# Altium project wifi-SA.PrjPcb
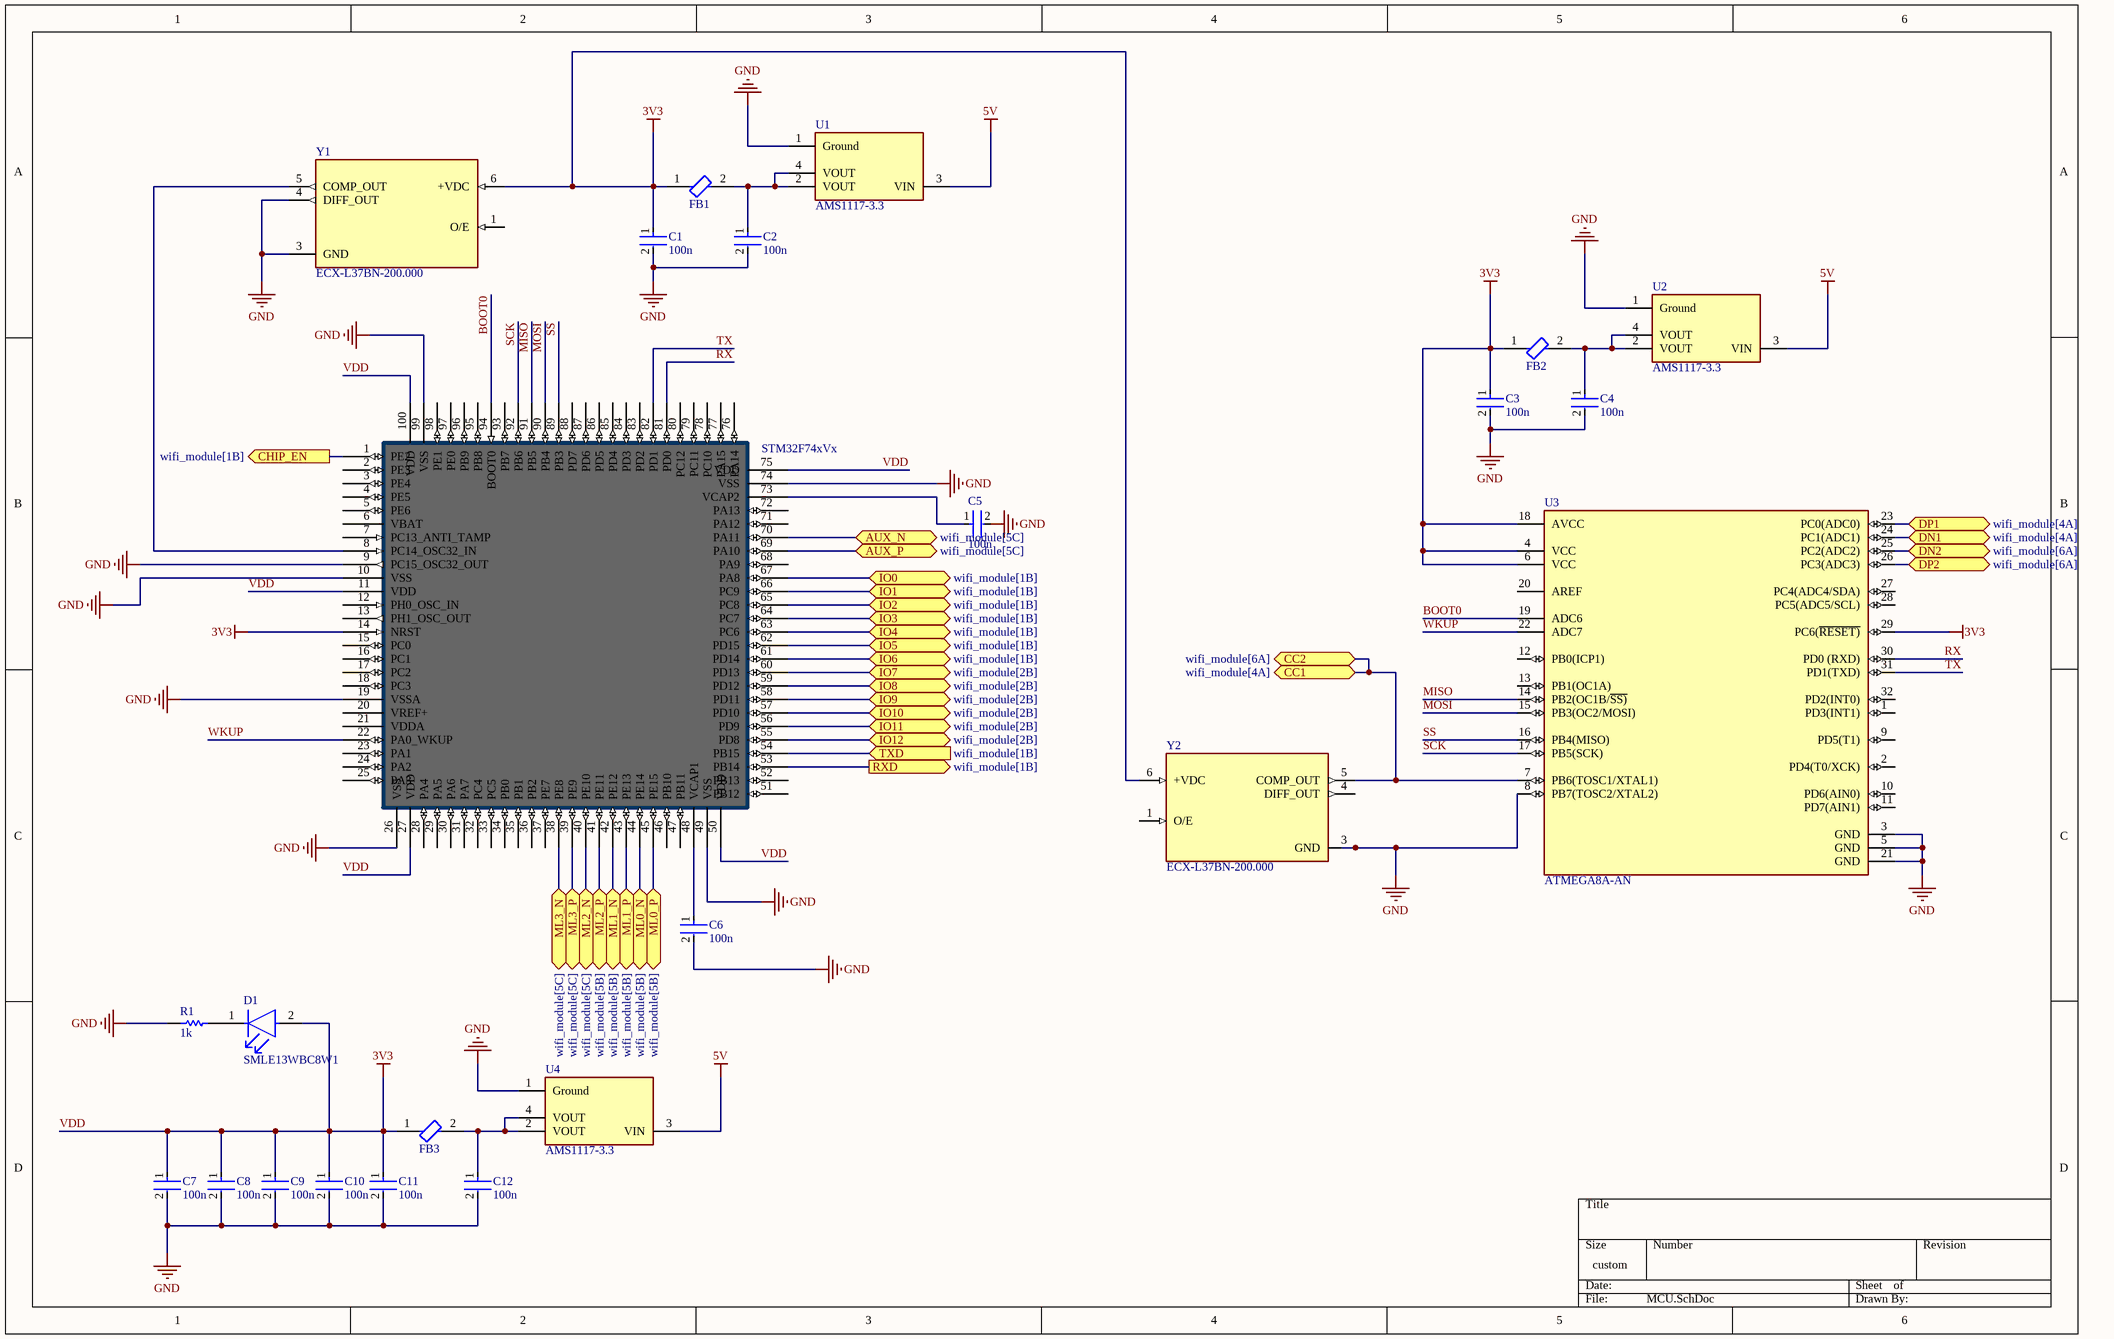
[diagram p0: MCU.SchDoc]
2 sheets, 36 parts. Net scope: flat (ports and power ports of the same name join across sheets).
Board file: wifi-SA.PcbDoc
Sheets:
  MCU.SchDoc
  wifi_module.SchDoc

## Sheet MCU.SchDoc
size 389 x 250 mm; SheetNumber: 1; SheetTotal: 2

### Parts
C1  100n  [FP-CL10-IPC_C]
C2  100n  [FP-CL10-IPC_C]
C3  100n  [FP-CL10-IPC_C]
C4  100n  [FP-CL10-IPC_C]
C5  100n  [FP-CL10-IPC_C]
C6  100n  [FP-CL10-IPC_C]
C7  100n  [FP-CL10-IPC_C]
C8  100n  [FP-CL10-IPC_C]
C9  100n  [FP-CL10-IPC_C]
C10  100n  [FP-CL10-IPC_C]
C11  100n  [FP-CL10-IPC_C]
C12  100n  [FP-CL10-IPC_C]
D1  SMLE13WBC8W1  [FP-SMLE13WBC8W1-MFG]
FB1  BLM18KG121TN1D  [FP-BLM18-0_15-t0_6-d1_2-IPC_A]  (value not drawn)
FB2  BLM18KG121TN1D  [FP-BLM18-0_15-t0_6-d1_2-IPC_A]  (value not drawn)
FB3  BLM18KG121TN1D  [FP-BLM18-0_15-t0_6-d1_2-IPC_A]  (value not drawn)
R1  1k  [RESC2013X60X35ML10T20]
U0  STM32F74xVx  [CQFP-STM32F74xVx]
U1  AMS1117-3.3  [FP-AMS1117-IPC_C]
U2  AMS1117-3.3  [FP-AMS1117-IPC_C]
U3  ATMEGA8A-AN  [FP-C04-074-PT-MFG]
U4  AMS1117-3.3  [FP-AMS1117-IPC_C]
Y1  ECX-L37BN-200.000  [OSC_ECX-L37BN-200.000]
Y2  ECX-L37BN-200.000  [OSC_ECX-L37BN-200.000]

### Ports
AUX_N (bidir, see wifi_module[5C]), AUX_P (bidir, see wifi_module[5C]), CC1 (bidir, see wifi_module[4A]), CC2 (bidir, see wifi_module[6A]), CHIP_EN (out, see wifi_module[1B]), DN1 (bidir, see wifi_module[4A]), DN2 (bidir, see wifi_module[6A]), DP1 (bidir, see wifi_module[4A]), DP2 (bidir, see wifi_module[6A]), IO0 (bidir, see wifi_module[1B]), IO1 (bidir, see wifi_module[1B]), IO2 (bidir, see wifi_module[1B]), IO3 (bidir, see wifi_module[1B]), IO4 (bidir, see wifi_module[1B]), IO5 (bidir, see wifi_module[1B]), IO6 (bidir, see wifi_module[1B]), IO7 (bidir, see wifi_module[2B]), IO8 (bidir, see wifi_module[2B]), IO9 (bidir, see wifi_module[2B]), IO10 (bidir, see wifi_module[2B]), IO11 (bidir, see wifi_module[2B]), IO12 (bidir, see wifi_module[2B]), ML0_N (bidir, see wifi_module[5B]), ML0_P (bidir, see wifi_module[5B]), ML1_N (bidir, see wifi_module[5B]), ML1_P (bidir, see wifi_module[5B]), ML2_N (bidir, see wifi_module[5C]), ML2_P (bidir, see wifi_module[5B]), ML3_N (bidir, see wifi_module[5C]), ML3_P (bidir, see wifi_module[5C]), RXD (out, see wifi_module[1B]), TXD (in, see wifi_module[1B])

### Nets
5V: U1.3(VIN) U2.3(VIN) U4.3(VIN)
GND: C1.2 C2.2 C3.2 C4.2 C5.2 C6.2 C7.2 C8.2 C9.2 C10.2 C11.2 C12.2 R1.1 U0.9(PC15_OSC32_OUT) U0.10(VSS) U0.19(VSSA) U0.26(VSS) U0.49(VSS) U0.74(VSS) U0.99(VSS) U1.1(Ground) U2.1(Ground) U3.3(GND) U3.5(GND) U3.8(PB7(TOSC2/XTAL2)) U3.21(GND) U4.1(Ground) Y1.3(GND) Y1.4(DIFF_OUT) Y2.3(GND)
VDD: C1.1 C3.1 C7.1 C8.1 C9.1 C10.1 C11.1 D1.2(A) FB1.1 FB2.1 FB3.1 U0.11(VDD) U0.14(NRST) U0.27(VDD) U0.50(VDD) U0.75(VDD) U0.100(VDD) U3.4(VCC) U3.6(VCC) U3.18(AVCC) U3.29(PC6(~{RESET)}) Y1.6(+VDC) Y2.6(+VDC)  [also labelled 3V3]
AUX_N: U0.70(PA11) ; port AUX_N
AUX_P: U0.69(PA10) ; port AUX_P
BOOT0: U0.94(BOOT0) U3.19(ADC6)
D1_N: U3.24(PC1(ADC1)) ; port DN1
D1_P: U3.23(PC0(ADC0)) ; port DP1
D2_N: U3.25(PC2(ADC2)) ; port DN2
D2_P: U3.26(PC3(ADC3)) ; port DP2
MISO: U0.91(PB5) U3.14(PB2(OC1B/~{SS)})
ML0_N: U0.44(PE14) ; port ML0_N
ML0_P: U0.45(PE15) ; port ML0_P
ML1_N: U0.42(PE12) ; port ML1_N
ML1_P: U0.43(PE13) ; port ML1_P
ML2_N: U0.40(PE10) ; port ML2_N
ML2_P: U0.41(PE11) ; port ML2_P
ML3_N: U0.38(PE8) ; port ML3_N
ML3_P: U0.39(PE9) ; port ML3_P
MOSI: U0.90(PB4) U3.15(PB3(OC2/MOSI))
RX: U0.81(PD0) U3.30(PD0_(RXD))
SCK: U0.92(PB6) U3.17(PB5(SCK))
SS: U0.89(PB3) U3.16(PB4(MISO))
TX: U0.82(PD1) U3.31(PD1(TXD))
WKUP: U0.22(PA0_WKUP) U3.22(ADC7)
NetC2_1: C2.1 FB1.2 U1.2(VOUT) U1.4(VOUT)
NetC4_1: C4.1 FB2.2 U2.2(VOUT) U2.4(VOUT)
NetC5_1: C5.1 U0.73(VCAP2)
NetC6_1: C6.1 U0.48(VCAP1)
NetC12_1: C12.1 FB3.2 U4.2(VOUT) U4.4(VOUT)
NetD1_1: D1.1(C) R1.2
NetJ1_A5: U3.7(PB6(TOSC1/XTAL1)) Y2.5(COMP_OUT) ; port CC2, port CC1
NetU0_1: U0.1(PE2) ; port CHIP_EN
NetU0_8: U0.8(PC14_OSC32_IN) Y1.5(COMP_OUT)
NetU0_53: U0.53(PB14) ; port RXD
NetU0_54: U0.54(PB15) ; port TXD
NetU0_55: U0.55(PD8) ; port IO12
NetU0_56: U0.56(PD9) ; port IO11
NetU0_57: U0.57(PD10) ; port IO10
NetU0_58: U0.58(PD11) ; port IO9
NetU0_59: U0.59(PD12) ; port IO8
NetU0_60: U0.60(PD13) ; port IO7
NetU0_61: U0.61(PD14) ; port IO6
NetU0_62: U0.62(PD15) ; port IO5
NetU0_63: U0.63(PC6) ; port IO4
NetU0_64: U0.64(PC7) ; port IO3
NetU0_65: U0.65(PC8) ; port IO2
NetU0_66: U0.66(PC9) ; port IO1
NetU0_67: U0.67(PA8) ; port IO0

Not connected (* = marked no-connect by the designer): U0 2(PE3) 3(PE4) 4(PE5) 5(PE6) 6(VBAT) 7(PC13_ANTI_TAMP) 12(PH0_OSC_IN) 13(PH1_OSC_OUT) 15(PC0) 16(PC1) 17(PC2) 18(PC3) 20(VREF+) 21(VDDA) 23(PA1) 24(PA2) 25(PA3) 28(PA4) 29(PA5) 30(PA6) 31(PA7) 32(PC4) 33(PC5) 34(PB0) 35(PB1) 36(PB2) 37(PE7) 46(PB10) 47(PB11) 51(PB12) 52(PB13) 68(PA9) 71(PA12) 72(PA13) 76(PA14) 77(PA15) 78(PC10) 79(PC11) 80(PC12) 83(PD2) 84(PD3) 85(PD4) 86(PD5) 87(PD6) 88(PD7) 93(PB7) 95(PB8) 96(PB9) 97(PE0) 98(PE1); U3 1(PD3(INT1)) 2(PD4(T0/XCK)) 9(PD5(T1)) 10(PD6(AIN0)) 11(PD7(AIN1)) 12(PB0(ICP1)) 13(PB1(OC1A)) 20(AREF) 27(PC4(ADC4/SDA)) 28(PC5(ADC5/SCL)) 32(PD2(INT0)); Y1 1(O/E); Y2 1(O/E) 4(DIFF_OUT)

### Library data of the parts
C1-C12 = CMP-13271-003017-1: Cap Ceramic 4.7uF 10V X5R ±10% Pad SMD 0603 +85°C T/R; Capacitance: 4.7uF; Case/Package: 0603; Packaging: Tape and Reel; Width: 0.031inch; Contact Plating: Tin; Thickness: 0.035inch; Package Quantity: 1; Voltage Rating: 10V; Case Code (Metric): 1608; Case Code (Imperial): 0603; Depth: 0.8mm; Height: 0.8mm; Tolerance: 10%; Max Operating Temperature: 85°C; Length: 1.6mm; Dielectric: X5R; Mount: Surface Mount; Radiation Hardening: No; Min Operating Temperature: -55°C
D1 = CMP-08952-000004-1: LED WHITE 0603 SMD; Manufacturer: Rohm; Luminous Intensity: 140mcd; Led Orientation: Top View; Reverse Voltage: 5V; Forward Voltage: 2.9V; Forward Current: 5mA; Power Dissipation: 66mW; Temperature Range Low: -40°C; Digikey Description: LED WHITE 0603 SMD; Temperature Range High: +85°C; Temperature: -40°C to +85°C; Manufacturer Part Number: SMLE13WBC8W1; Colour: White; Mouser Description: Standard LEDs - SMD ExceLED White LED 120mcd 5mA; Octopart: https://octopart.com/smle13wbc8w1-rohm-22224565; Automotive: No; Device Class L2: LEDs; Lead Free: Yes; ComponentLink2URL: https://media.digikey.com/pdf/Data%20Sheets/Rohm%20PDFs/SMLE13WBC8W1_Spec.pdf; Device Class L3: unset; Package: 0; RoHS: TRUE; Height: 0.4mm; Category: Diode; Device Class L1: Optoelectronics; ComponentLink2Description: Datasheet
FB1-FB3 = CMP-0686-00554-8: FERRITE BEAD 120 OHM 0603 1LN; Max Current Rating: 3A; DC Resistance (DCR): 30mR; Impedance: 120R; Number of Lines: 1; Test Frequency: 100MHz; Tolerance: 25%; Package Quantity: 4000; Min Operating Temperature: -55°C; Termination: SMD/SMT; REACH SVHC: No SVHC; Core Material: Ferrite; Material: Ferrite; Current Rating: 3A; Height: 0.8mm; Number of Pins: 2; Case/Package: 0603; Case Code (Imperial): 0603; Series: BLM18K; Packaging: Tape and Reel; Inductor Type: FERRITE BEAD; Lead Free: Lead Free; Width: 0.8mm; Case Code (Metric): 1608; Number of Circuits: 1; Max DC Current: 3A; Depth: 0.95mm; Max Operating Temperature: 125°C; Length: 1.6mm; RoHS Compliant: Yes
R1 = CMP-2100-03673-1: Chip Resistor, 0 Ohm, Jumper, +/- 5%, 0.125 W, -55 to 155 degC, 0805 (2012 Metric), RoHS, Tape and Reel; Manufacturer: Yageo; Power Rating: 125mW; Resistance: 0mOhm; Voltage Rating (DC): 150V; Temperature Coefficient: 200ppm/degreesC; Height: 0.5mm; Depth: 1.25mm; Case Code (Imperial): 0805; Lead Free: LeadFree; Military Standard: Not; Package Description: 2-Pin Surface Mounted Device, Body 2 x 1.25 mm; Case Code (Metric): 2012; Composition: ThickFilm; Voltage Rating: 150V; Manufacturer URL: http://www.yageo.com/; Packaging: TapeandReel; Package Reference: 0805; REACH SVHC: Unknown; Tolerance: 5%; Case/Package: 0805; Max Operating Temperature: 155degC; Number of Pins: 2; Min Operating Temperature: -55degC; RoHSCompliant: true; Length: 2mm; Datasheet URL: http://www.yageo.com/NewPortal/yageodocoutput?fileName=/pdf/R-Chip/PYu-RC_Group_51_RoHS_L_5.pdf; Termination: SMD/SMT; Radiation Hardening: No; Width: 1.25mm; Contact Plating: Tin; Datasheet Version: Rev. 5, 10/2016
U0 = STM32F74xVx: STM32F74xVx LQFP100 pinout
U1 U2 U4 = CMP-209535-000001-1: LDO Voltage Regulators 1A, 3.3V; Manufacturer: Advanced Monolithic Systems; Dropout Voltage: 1.1V; Output Type: Fixed; Nominal Supply Current: 5mA; Max Power Dissipation: 1.2W; Max Supply Voltage: 15V; Number Of Outputs: 1; Standoff Height: 0.64mm; Max Junction Temp: +125°C; Height: 1.8mm; Package: AMS1117; Device Class L2: Power Management ICs; ComponentLink2Description: Datasheet; ComponentLink2URL: http://www.advanced-monolithic.com/pdf/ds1117.pdf; Category: IC; RoHS: TRUE; Automotive: No; Device Class L1: Integrated Circuits (ICs); Output Current: 1A; Device Class L3: Voltage Regulators - Linear; Temperature: -40°C to +125°C; Output Voltage: 3.3V; Manufacturer Part Number: AMS1117-3.3; Temperature Range Low: -40°C; Octopart: https://octopart.com/ams1117-3.3-advanced+monolithic+systems-25899300; Lead Free: Yes; Ipc Land Pattern Name: SOT229P700X180-4; Temperature Range High: +125°C
U3 = CMP-00252-77760635-1: ATMEGA8A-AN RISC Microcontroller, 8-Bit, FLASH, 16MHz, CMOS, PQFP32; Oscillator Type: Internal; Interface: I2C, SPI, UART, USART; Max Supply Voltage: 5.5V; Memory Size: 8kB; Core Architecture: AVR; Number of Timers/Counters: 3; Min Supply Voltage: 2.7V; Number of I/Os: 23; Peripherals: Brown-out Detect/Reset, POR, PWM, WDT; Data Bus Width: 8b; RAM Size: 1kB; Max Operating Temperature: 105°C; Frequency: 16MHz; RoHS: Compliant; Memory Type: FLASH; Min Operating Temperature: -40°C; Max Frequency: 16MHz; Lifecycle Status: Production; NexarPartId: 77760635; Case/Package: TQFP; Number of Pins: 32
Y1 Y2 = ECX-L37BN-200.000: 200 MHz XO (Standard) LVDS Oscillator 3.3V Enable/Disable 6-SMD, No Lead; MF: ECS Inc.; MP: ECX-L37BN-200.000; Package: SMD-6 ECS International; Purchase-URL: https://pricing.snapeda.com/search/part/ECX-L37BN-200.000/?ref=eda; Price: None; Value: *; SnapEDA_Link: https://www.snapeda.com/parts/ECX-L37BN-200.000/ECS+Inc./view-part/?ref=snap; Check_prices: https://www.snapeda.com/parts/ECX-L37BN-200.000/ECS+Inc./view-part/?ref=eda; Availability: In Stock

## Sheet wifi_module.SchDoc
size 389 x 250 mm; SheetNumber: 2; SheetTotal: 2
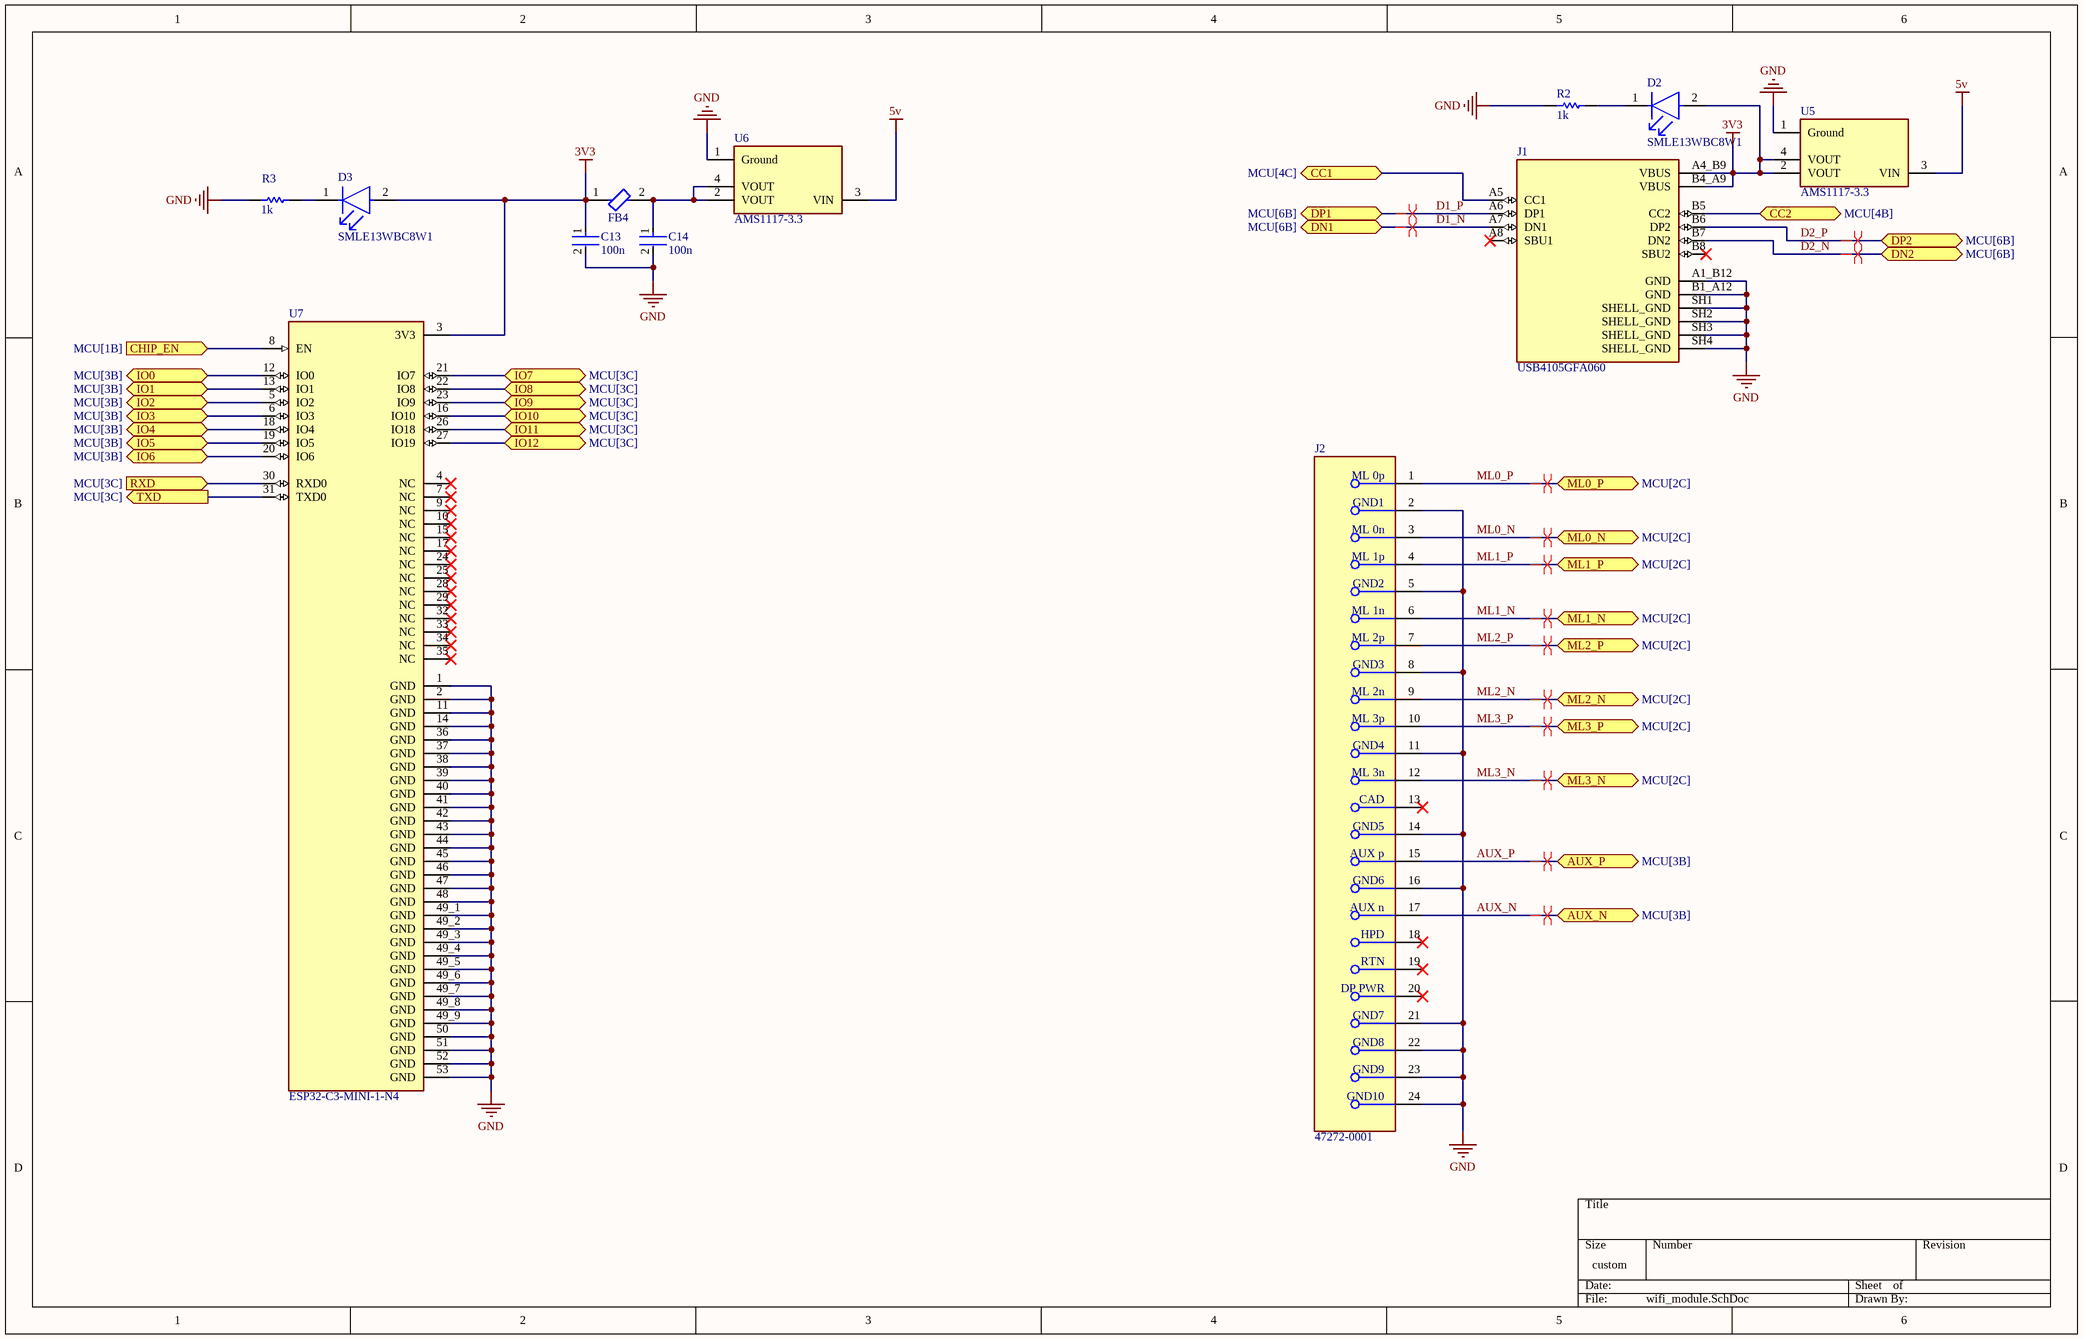
[diagram p1: wifi_module.SchDoc]

### Parts
C13  100n  [FP-CL10-IPC_C]
C14  100n  [FP-CL10-IPC_C]
D2  SMLE13WBC8W1  [FP-SMLE13WBC8W1-MFG]
D3  SMLE13WBC8W1  [FP-SMLE13WBC8W1-MFG]
FB4  BLM18KG121TN1D  [FP-BLM18-0_15-t0_6-d1_2-IPC_A]  (value not drawn)
J1  USB4105GFA060  [GCT_USB4105GFA060]
J2  47272-0001  [FP-47272-0001-MFG]
R2  1k  [RESC2013X60X35ML10T20]
R3  1k  [RESC2013X60X35ML10T20]
U5  AMS1117-3.3  [FP-AMS1117-IPC_C]
U6  AMS1117-3.3  [FP-AMS1117-IPC_C]
U7  ESP32-C3-MINI-1-N4  [XCVR_ESP32-C3-MINI-1-N4]

### Ports
AUX_N (bidir, see MCU[3B]), AUX_P (bidir, see MCU[3B]), CC1 (bidir, see MCU[4C]), CC2 (bidir, see MCU[4B]), CHIP_EN (in, see MCU[1B]), DN1 (bidir, see MCU[6B]), DN2 (bidir, see MCU[6B]), DP1 (bidir, see MCU[6B]), DP2 (bidir, see MCU[6B]), IO0 (bidir, see MCU[3B]), IO1 (bidir, see MCU[3B]), IO2 (bidir, see MCU[3B]), IO3 (bidir, see MCU[3B]), IO4 (bidir, see MCU[3B]), IO5 (bidir, see MCU[3B]), IO6 (bidir, see MCU[3B]), IO7 (bidir, see MCU[3C]), IO8 (bidir, see MCU[3C]), IO9 (bidir, see MCU[3C]), IO10 (bidir, see MCU[3C]), IO11 (bidir, see MCU[3C]), IO12 (bidir, see MCU[3C]), ML0_N (bidir, see MCU[2C]), ML0_P (bidir, see MCU[2C]), ML1_N (bidir, see MCU[2C]), ML1_P (bidir, see MCU[2C]), ML2_N (bidir, see MCU[2C]), ML2_P (bidir, see MCU[2C]), ML3_N (bidir, see MCU[2C]), ML3_P (bidir, see MCU[2C]), RXD (in, see MCU[3C]), TXD (out, see MCU[3C])

### Nets
3V3: C13.1 D2.2(A) D3.2(A) FB4.1 J1.A4_B9(VBUS) J1.B4_A9(VBUS) U5.2(VOUT) U5.4(VOUT) U7.3(3V3)  [project net VDD]
5V: U5.3(VIN) U6.3(VIN)
GND: C13.2 C14.2 J1.A1_B12(GND) J1.B1_A12(GND) J1.SH1(SHELL_GND) J1.SH2(SHELL_GND) J1.SH3(SHELL_GND) J1.SH4(SHELL_GND) J2.2(GND1) J2.5(GND2) J2.8(GND3) J2.11(GND4) J2.14(GND5) J2.16(GND6) J2.21(GND7) J2.22(GND8) J2.23(GND9) J2.24(GND10) R2.1 R3.1 U5.1(Ground) U6.1(Ground) U7.1(GND) U7.2(GND) U7.11(GND) U7.14(GND) U7.36(GND) U7.37(GND) U7.38(GND) U7.39(GND) U7.40(GND) U7.41(GND) U7.42(GND) U7.43(GND) U7.44(GND) U7.45(GND) U7.46(GND) U7.47(GND) U7.48(GND) U7.49_1(GND) U7.49_2(GND) U7.49_3(GND) U7.49_4(GND) U7.49_5(GND) U7.49_6(GND) U7.49_7(GND) U7.49_8(GND) U7.49_9(GND) U7.50(GND) U7.51(GND) U7.52(GND) U7.53(GND)
AUX_N: J2.17(AUX_n) ; port AUX_N
AUX_P: J2.15(AUX_p) ; port AUX_P
D1_N: J1.A7(DN1) ; port DN1
D1_P: J1.A6(DP1) ; port DP1
D2_N: J1.B7(DN2) ; port DN2
D2_P: J1.B6(DP2) ; port DP2
ML0_N: J2.3(ML_0n) ; port ML0_N
ML0_P: J2.1(ML_0p) ; port ML0_P
ML1_N: J2.6(ML_1n) ; port ML1_N
ML1_P: J2.4(ML_1p) ; port ML1_P
ML2_N: J2.9(ML_2n) ; port ML2_N
ML2_P: J2.7(ML_2p) ; port ML2_P
ML3_N: J2.12(ML_3n) ; port ML3_N
ML3_P: J2.10(ML_3p) ; port ML3_P
NetC14_1: C14.1 FB4.2 U6.2(VOUT) U6.4(VOUT)
NetD2_1: D2.1(C) R2.2
NetD3_1: D3.1(C) R3.2
NetJ1_A5: J1.A5(CC1) J1.B5(CC2) ; port CC1, port CC2
NetU0_1: U7.8(EN) ; port CHIP_EN
NetU0_53: U7.30(RXD0) ; port RXD
NetU0_54: U7.31(TXD0) ; port TXD
NetU0_55: U7.27(IO19) ; port IO12
NetU0_56: U7.26(IO18) ; port IO11
NetU0_57: U7.16(IO10) ; port IO10
NetU0_58: U7.23(IO9) ; port IO9
NetU0_59: U7.22(IO8) ; port IO8
NetU0_60: U7.21(IO7) ; port IO7
NetU0_61: U7.20(IO6) ; port IO6
NetU0_62: U7.19(IO5) ; port IO5
NetU0_63: U7.18(IO4) ; port IO4
NetU0_64: U7.6(IO3) ; port IO3
NetU0_65: U7.5(IO2) ; port IO2
NetU0_66: U7.13(IO1) ; port IO1
NetU0_67: U7.12(IO0) ; port IO0

Not connected (* = marked no-connect by the designer): J1 A8(SBU1)* B8(SBU2)*; J2 13(CAD)* 18(HPD)* 19(RTN)* 20(DP_PWR)*; U7 4(NC)* 7(NC)* 9(NC)* 10(NC)* 15(NC)* 17(NC)* 24(NC)* 25(NC)* 28(NC)* 29(NC)* 32(NC)* 33(NC)* 34(NC)* 35(NC)*

### Layout directives
differential pair: AUX_N, AUX_P, D1_N, D1_P, D2_N, D2_P, ML0_N, ML0_P, ML1_N, ML1_P, ML2_N, ML2_P, ML3_N, ML3_P

### Library data of the parts
C13 C14 = CMP-13271-003017-1: as C1 on sheet MCU; Capacitance: 4.7uF; Case/Package: 0603; Packaging: Tape and Reel; Width: 0.031inch; Contact Plating: Tin; Thickness: 0.035inch; Package Quantity: 1; Voltage Rating: 10V; Case Code (Metric): 1608; Case Code (Imperial): 0603; Depth: 0.8mm; Height: 0.8mm; Tolerance: 10%; Max Operating Temperature: 85°C; Length: 1.6mm; Dielectric: X5R; Mount: Surface Mount; Radiation Hardening: No; Min Operating Temperature: -55°C
D2 D3 = CMP-08952-000004-1: as D1 on sheet MCU; Temperature Range Low: -40°C; Digikey Description: LED WHITE 0603 SMD; Temperature Range High: +85°C; Temperature: -40°C to +85°C; Manufacturer Part Number: SMLE13WBC8W1; Colour: White; Mouser Description: Standard LEDs - SMD ExceLED White LED 120mcd 5mA; Octopart: https://octopart.com/smle13wbc8w1-rohm-22224565; Automotive: No; Device Class L2: LEDs; Lead Free: Yes; ComponentLink2URL: https://media.digikey.com/pdf/Data%20Sheets/Rohm%20PDFs/SMLE13WBC8W1_Spec.pdf; Device Class L3: unset; Package: 0; RoHS: TRUE; Height: 0.4mm; Category: Diode; Device Class L1: Optoelectronics; ComponentLink2Description: Datasheet
FB4 = CMP-0686-00554-8: as FB1 on sheet MCU; Package Quantity: 4000; Min Operating Temperature: -55°C; Termination: SMD/SMT; REACH SVHC: No SVHC; Core Material: Ferrite; Material: Ferrite; Current Rating: 3A; Height: 0.8mm; Number of Pins: 2; Case/Package: 0603; Case Code (Imperial): 0603; Series: BLM18K; Packaging: Tape and Reel; Inductor Type: FERRITE BEAD; Lead Free: Lead Free; Width: 0.8mm; Case Code (Metric): 1608; Number of Circuits: 1; Max DC Current: 3A; Depth: 0.95mm; Max Operating Temperature: 125°C; Length: 1.6mm; RoHS Compliant: Yes
J1 = USB4105GFA060: MF: {'manufacturer': u'GCT'}; Package: None; Price: None; Value: *; MP: USB4105GFA060; Availability: Unavailable
J2 = CMP-2000-05608-2: CONN RCPT DISPLAYPORT 20P SMD RA; Manufacturer: Molex; Voltage Rating: 40V; Is Female: yes; Shielding: true; Number Of Contacts: 20; Conn Orientation: Right Angle; Current Rating: 0.5A; Pitch: 0.5mm; Device Class L2: Audio / Video Connectors; Temperature: -20°C to +85°C; Contact Material: Gold,Nickel; Footprint Url: https://www.molex.com/pdm_docs/sd/472720001_sd.pdf; Device Class L1: Connectors; ComponentLink2Description: Datasheet; Temperature Range Low: -20°C; Automotive: No; Package: 0; Height: 6.9mm; RoHS: TRUE; Octopart: https://octopart.com/47272-0001-molex-5441289; Lead Free: Yes; ComponentLink2URL: https://www.molex.com/webdocs/datasheets/pdf/en-us/0472720001_IO_CONNECTORS.pdf; Device Class L3: unset; Mouser Description: HDMI, Displayport & DVI Connectors .5MM RA SMT RCPT; Category: Conn; Manufacturer Part Number: 47272-0001; Digikey Description: CONN RCPT DISPLAYPORT 20P SMD RA; Temperature Range High: +85°C
R2 R3 = CMP-2100-03673-1: as R1 on sheet MCU; Height: 0.5mm; Depth: 1.25mm; Case Code (Imperial): 0805; Lead Free: LeadFree; Military Standard: Not; Package Description: 2-Pin Surface Mounted Device, Body 2 x 1.25 mm; Case Code (Metric): 2012; Composition: ThickFilm; Voltage Rating: 150V; Manufacturer URL: http://www.yageo.com/; Packaging: TapeandReel; Package Reference: 0805; REACH SVHC: Unknown; Tolerance: 5%; Case/Package: 0805; Max Operating Temperature: 155degC; Number of Pins: 2; Min Operating Temperature: -55degC; RoHSCompliant: true; Length: 2mm; Datasheet URL: http://www.yageo.com/NewPortal/yageodocoutput?fileName=/pdf/R-Chip/PYu-RC_Group_51_RoHS_L_5.pdf; Termination: SMD/SMT; Radiation Hardening: No; Width: 1.25mm; Contact Plating: Tin; Datasheet Version: Rev. 5, 10/2016
U5 U6 = CMP-209535-000001-1: as U1 on sheet MCU; Height: 1.8mm; Package: AMS1117; Device Class L2: Power Management ICs; ComponentLink2Description: Datasheet; ComponentLink2URL: http://www.advanced-monolithic.com/pdf/ds1117.pdf; Category: IC; RoHS: TRUE; Automotive: No; Device Class L1: Integrated Circuits (ICs); Output Current: 1A; Device Class L3: Voltage Regulators - Linear; Temperature: -40°C to +125°C; Output Voltage: 3.3V; Manufacturer Part Number: AMS1117-3.3; Temperature Range Low: -40°C; Octopart: https://octopart.com/ams1117-3.3-advanced+monolithic+systems-25899300; Lead Free: Yes; Ipc Land Pattern Name: SOT229P700X180-4; Temperature Range High: +125°C
U7 = ESP32-C3-MINI-1-N4: Bluetooth, WiFi 802.11b/g/n, Bluetooth v5.0 Transceiver Module 2.412GHz ~ 2.484GHz PCB Trace Surface Mount; MF: Espressif Systems; SnapEDA_Link: https://www.snapeda.com/parts/ESP32-C3-MINI-1-N4/Espressif+Systems/view-part/?ref=snap; Package: SMD-53 Espressif Systems; Value: *; MP: ESP32-C3-MINI-1-N4; Check_prices: https://www.snapeda.com/parts/ESP32-C3-MINI-1-N4/Espressif+Systems/view-part/?ref=eda

## Nets that join several sheets
5V: MCU (U1.3 U2.3 U4.3), wifi_module (U5.3 U6.3)
GND: MCU (30 pins), wifi_module (52 pins)
VDD: MCU (23 pins), wifi_module (9 pins)
AUX_N: MCU (U0.70), wifi_module (J2.17)
AUX_P: MCU (U0.69), wifi_module (J2.15)
D1_N: MCU (U3.24), wifi_module (J1.A7)
D1_P: MCU (U3.23), wifi_module (J1.A6)
D2_N: MCU (U3.25), wifi_module (J1.B7)
D2_P: MCU (U3.26), wifi_module (J1.B6)
ML0_N: MCU (U0.44), wifi_module (J2.3)
ML0_P: MCU (U0.45), wifi_module (J2.1)
ML1_N: MCU (U0.42), wifi_module (J2.6)
ML1_P: MCU (U0.43), wifi_module (J2.4)
ML2_N: MCU (U0.40), wifi_module (J2.9)
ML2_P: MCU (U0.41), wifi_module (J2.7)
ML3_N: MCU (U0.38), wifi_module (J2.12)
ML3_P: MCU (U0.39), wifi_module (J2.10)
NetJ1_A5: MCU (U3.7 Y2.5), wifi_module (J1.A5 J1.B5)
NetU0_1: MCU (U0.1), wifi_module (U7.8)
NetU0_53: MCU (U0.53), wifi_module (U7.30)
NetU0_54: MCU (U0.54), wifi_module (U7.31)
NetU0_55: MCU (U0.55), wifi_module (U7.27)
NetU0_56: MCU (U0.56), wifi_module (U7.26)
NetU0_57: MCU (U0.57), wifi_module (U7.16)
NetU0_58: MCU (U0.58), wifi_module (U7.23)
NetU0_59: MCU (U0.59), wifi_module (U7.22)
NetU0_60: MCU (U0.60), wifi_module (U7.21)
NetU0_61: MCU (U0.61), wifi_module (U7.20)
NetU0_62: MCU (U0.62), wifi_module (U7.19)
NetU0_63: MCU (U0.63), wifi_module (U7.18)
NetU0_64: MCU (U0.64), wifi_module (U7.6)
NetU0_65: MCU (U0.65), wifi_module (U7.5)
NetU0_66: MCU (U0.66), wifi_module (U7.13)
NetU0_67: MCU (U0.67), wifi_module (U7.12)